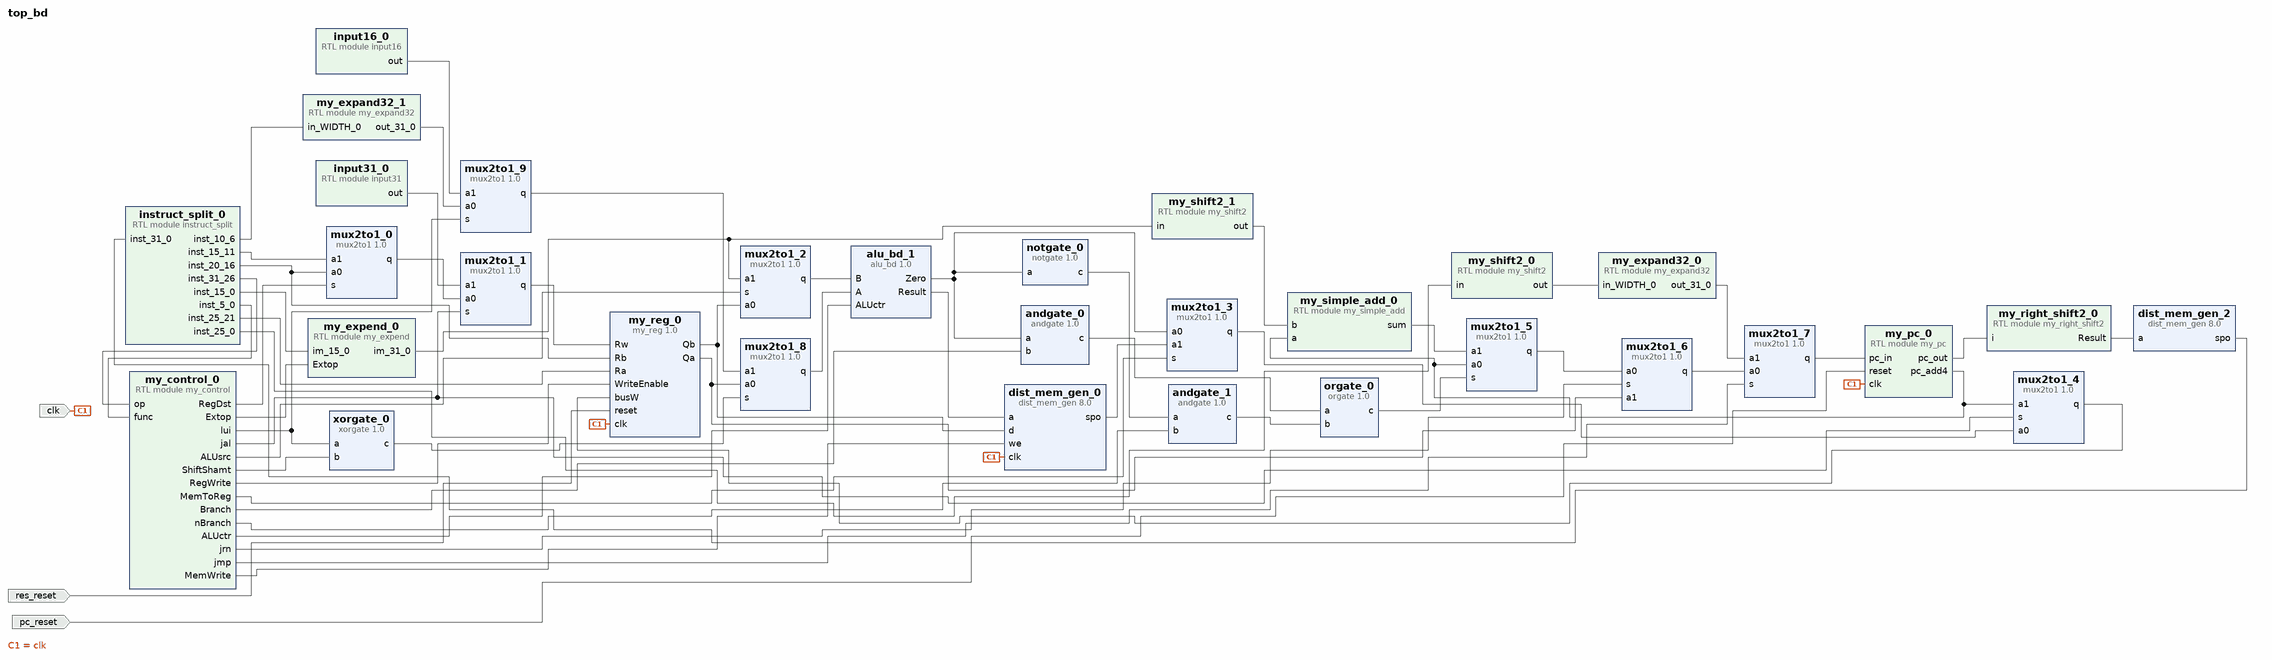
[diagram p0: block diagram of the top level]
# Vivado block design top_bd, Vivado 2015.4
create_bd_design top_bd

create_bd_port -dir I -type clk clk
set_property -dict {CONFIG.FREQ_HZ 1000000} [get_bd_ports clk]
create_bd_port -dir I pc_reset
create_bd_port -dir I res_reset

create_bd_cell -type ip -vlnv CSE:CSE:mux2to1:1.0 mux2to1_0
set_property -dict {CONFIG.WIDTH 5} [get_bd_cells mux2to1_0]
create_bd_cell -type ip -vlnv CSE:CSE:mux2to1:1.0 mux2to1_1
set_property -dict {CONFIG.WIDTH 5} [get_bd_cells mux2to1_1]
create_bd_cell -type ip -vlnv CSE:CSE:mux2to1:1.0 mux2to1_2
set_property -dict {CONFIG.WIDTH 32} [get_bd_cells mux2to1_2]
create_bd_cell -type ip -vlnv CSE:CSE:mux2to1:1.0 mux2to1_3
set_property -dict {CONFIG.WIDTH 32} [get_bd_cells mux2to1_3]
create_bd_cell -type ip -vlnv CSE:CSE:mux2to1:1.0 mux2to1_4
set_property -dict {CONFIG.WIDTH 32} [get_bd_cells mux2to1_4]
create_bd_cell -type ip -vlnv CSE:CSE:mux2to1:1.0 mux2to1_5
set_property -dict {CONFIG.WIDTH 32} [get_bd_cells mux2to1_5]
create_bd_cell -type ip -vlnv CSE:CSE:andgate:1.0 andgate_0
set_property -dict {CONFIG.WIDTH 1} [get_bd_cells andgate_0]
create_bd_cell -type ip -vlnv CSE:CSE:andgate:1.0 andgate_1
set_property -dict {CONFIG.WIDTH 1} [get_bd_cells andgate_1]
create_bd_cell -type ip -vlnv CSE:CSE:notgate:1.0 notgate_0
set_property -dict {CONFIG.WIDTH 1} [get_bd_cells notgate_0]
create_bd_cell -type ip -vlnv CSE:CSE:orgate:1.0 orgate_0
set_property -dict {CONFIG.WIDTH 1} [get_bd_cells orgate_0]
create_bd_cell -type module -reference my_expend my_expend_0
create_bd_cell -type module -reference my_expand32 my_expand32_0
set_property -dict {CONFIG.WIDTH 26} [get_bd_cells my_expand32_0]
create_bd_cell -type module -reference my_simple_add my_simple_add_0
set_property -dict {CONFIG.WIDTH 32} [get_bd_cells my_simple_add_0]
create_bd_cell -type ip -vlnv CSE:CSE:mux2to1:1.0 mux2to1_6
set_property -dict {CONFIG.WIDTH 32} [get_bd_cells mux2to1_6]
create_bd_cell -type ip -vlnv CSE:CSE:mux2to1:1.0 mux2to1_7
set_property -dict {CONFIG.WIDTH 32} [get_bd_cells mux2to1_7]
create_bd_cell -type module -reference instruct_split instruct_split_0
create_bd_cell -type ip -vlnv CSE:CSE:mux2to1:1.0 mux2to1_8
set_property -dict {CONFIG.WIDTH 32} [get_bd_cells mux2to1_8]
create_bd_cell -type ip -vlnv CSE:CSE:mux2to1:1.0 mux2to1_9
set_property -dict {CONFIG.WIDTH 32} [get_bd_cells mux2to1_9]
create_bd_cell -type module -reference input16 input16_0
create_bd_cell -type ip -vlnv CSE:CSE:xorgate:1.0 xorgate_0
set_property -dict {CONFIG.WIDTH 1} [get_bd_cells xorgate_0]
create_bd_cell -type module -reference my_right_shift2 my_right_shift2_0
create_bd_cell -type module -reference my_pc my_pc_0
create_bd_cell -type module -reference my_shift2 my_shift2_1
set_property -dict {CONFIG.WIDTH 32} [get_bd_cells my_shift2_1]
create_bd_cell -type module -reference input31 input31_0
create_bd_cell -type module -reference my_control my_control_0
create_bd_cell -type ip -vlnv CSE:CSE:my_reg:1.0 my_reg_0
create_bd_cell -type ip -vlnv CSE:CSE:alu_bd:1.0 alu_bd_1
create_bd_cell -type module -reference my_expand32 my_expand32_1
set_property -dict {CONFIG.WIDTH 5} [get_bd_cells my_expand32_1]
create_bd_cell -type module -reference my_shift2 my_shift2_0
set_property -dict {CONFIG.WIDTH 26} [get_bd_cells my_shift2_0]
create_bd_cell -type ip -vlnv xilinx.com:ip:dist_mem_gen:8.0 dist_mem_gen_2
set_property -dict [list \
  CONFIG.depth 65536 \
  CONFIG.data_width 32 \
  CONFIG.memory_type rom \
  CONFIG.coefficient_file ../../../../../../../../SOC/CPU/UnitTest/fib/prgmip32.coe \
] [get_bd_cells dist_mem_gen_2]
create_bd_cell -type ip -vlnv xilinx.com:ip:dist_mem_gen:8.0 dist_mem_gen_0
set_property -dict [list \
  CONFIG.depth 65536 \
  CONFIG.data_width 32 \
  CONFIG.coefficient_file ../../../../../../../../SOC/CPU/UnitTest/fib/dmem32.coe \
] [get_bd_cells dist_mem_gen_0]

# ---- connections ----

connect_bd_net [get_bd_pins my_pc_0/pc_out] [get_bd_pins my_right_shift2_0/i]
connect_bd_net [get_bd_pins instruct_split_0/inst_31_26] [get_bd_pins my_control_0/op]
connect_bd_net [get_bd_pins instruct_split_0/inst_5_0] [get_bd_pins my_control_0/func]
connect_bd_net [get_bd_pins instruct_split_0/inst_15_0] [get_bd_pins my_expend_0/im_15_0]
connect_bd_net [get_bd_pins my_control_0/jal] [get_bd_pins mux2to1_1/s] [get_bd_pins mux2to1_4/s]
connect_bd_net [get_bd_pins my_control_0/RegDst] [get_bd_pins mux2to1_0/s]
connect_bd_net [get_bd_pins mux2to1_0/q] [get_bd_pins mux2to1_1/a0]
connect_bd_net [get_bd_pins my_expend_0/im_31_0] [get_bd_pins mux2to1_2/a1] [get_bd_pins my_shift2_1/in]
connect_bd_net [get_bd_pins my_control_0/ALUsrc] [get_bd_pins mux2to1_2/s]
connect_bd_net [get_bd_pins my_control_0/MemToReg] [get_bd_pins mux2to1_3/s]
connect_bd_net [get_bd_pins my_pc_0/pc_add4] [get_bd_pins mux2to1_4/a1] [get_bd_pins my_simple_add_0/a] [get_bd_pins mux2to1_5/a0]
connect_bd_net [get_bd_pins mux2to1_3/q] [get_bd_pins mux2to1_4/a0]
connect_bd_net [get_bd_pins my_control_0/Extop] [get_bd_pins my_expend_0/Extop]
connect_bd_net [get_bd_pins andgate_0/c] [get_bd_pins orgate_0/a]
connect_bd_net [get_bd_pins andgate_1/c] [get_bd_pins orgate_0/b]
connect_bd_net [get_bd_pins my_control_0/nBranch] [get_bd_pins andgate_1/b]
connect_bd_net [get_bd_pins my_control_0/Branch] [get_bd_pins andgate_0/b]
connect_bd_net [get_bd_pins orgate_0/c] [get_bd_pins mux2to1_5/s]
connect_bd_net [get_bd_pins my_shift2_1/out] [get_bd_pins my_simple_add_0/b]
connect_bd_net [get_bd_pins my_simple_add_0/sum] [get_bd_pins mux2to1_5/a1]
connect_bd_net [get_bd_pins mux2to1_5/q] [get_bd_pins mux2to1_6/a0]
connect_bd_net [get_bd_pins my_control_0/jrn] [get_bd_pins mux2to1_6/s]
connect_bd_net [get_bd_pins mux2to1_6/q] [get_bd_pins mux2to1_7/a0]
connect_bd_net [get_bd_pins my_expand32_0/out_31_0] [get_bd_pins mux2to1_7/a1]
connect_bd_net [get_bd_pins my_control_0/jmp] [get_bd_pins mux2to1_7/s]
connect_bd_net [get_bd_pins mux2to1_7/q] [get_bd_pins my_pc_0/pc_in]
connect_bd_net [get_bd_ports clk] [get_bd_pins my_pc_0/clk] [get_bd_pins my_reg_0/clk] [get_bd_pins dist_mem_gen_0/clk]
connect_bd_net [get_bd_ports pc_reset] [get_bd_pins my_pc_0/reset]
connect_bd_net [get_bd_pins instruct_split_0/inst_10_6] [get_bd_pins my_expand32_1/in_WIDTH_0]
connect_bd_net [get_bd_pins my_control_0/lui] [get_bd_pins mux2to1_9/s] [get_bd_pins xorgate_0/a]
connect_bd_net [get_bd_pins input16_0/out] [get_bd_pins mux2to1_9/a1]
connect_bd_net [get_bd_pins my_expand32_1/out_31_0] [get_bd_pins mux2to1_9/a0]
connect_bd_net [get_bd_pins mux2to1_9/q] [get_bd_pins mux2to1_8/a1]
connect_bd_net [get_bd_pins my_control_0/ShiftShamt] [get_bd_pins xorgate_0/b]
connect_bd_net [get_bd_pins xorgate_0/c] [get_bd_pins mux2to1_8/s]
connect_bd_net [get_bd_pins instruct_split_0/inst_15_11] [get_bd_pins mux2to1_0/a1]
connect_bd_net [get_bd_pins input31_0/out] [get_bd_pins mux2to1_1/a1]
connect_bd_net [get_bd_pins notgate_0/c] [get_bd_pins andgate_1/a]
connect_bd_net [get_bd_pins my_shift2_0/out] [get_bd_pins my_expand32_0/in_WIDTH_0]
connect_bd_net [get_bd_pins instruct_split_0/inst_25_0] [get_bd_pins my_shift2_0/in]
connect_bd_net [get_bd_ports res_reset] [get_bd_pins my_reg_0/reset]
connect_bd_net [get_bd_pins mux2to1_1/q] [get_bd_pins my_reg_0/Rw]
connect_bd_net [get_bd_pins instruct_split_0/inst_25_21] [get_bd_pins my_reg_0/Ra]
connect_bd_net [get_bd_pins instruct_split_0/inst_20_16] [get_bd_pins mux2to1_0/a0] [get_bd_pins my_reg_0/Rb]
connect_bd_net [get_bd_pins my_control_0/RegWrite] [get_bd_pins my_reg_0/WriteEnable]
connect_bd_net [get_bd_pins mux2to1_4/q] [get_bd_pins my_reg_0/busW]
connect_bd_net [get_bd_pins my_reg_0/Qa] [get_bd_pins mux2to1_6/a1] [get_bd_pins mux2to1_8/a0]
connect_bd_net [get_bd_pins my_reg_0/Qb] [get_bd_pins mux2to1_2/a0] [get_bd_pins dist_mem_gen_0/d]
connect_bd_net [get_bd_pins mux2to1_8/q] [get_bd_pins alu_bd_1/A]
connect_bd_net [get_bd_pins my_control_0/ALUctr] [get_bd_pins alu_bd_1/ALUctr]
connect_bd_net [get_bd_pins mux2to1_2/q] [get_bd_pins alu_bd_1/B]
connect_bd_net [get_bd_pins alu_bd_1/Zero] [get_bd_pins andgate_0/a] [get_bd_pins notgate_0/a] [get_bd_pins mux2to1_3/a0]
connect_bd_net [get_bd_pins my_right_shift2_0/Result] [get_bd_pins dist_mem_gen_2/a]
connect_bd_net [get_bd_pins dist_mem_gen_2/spo] [get_bd_pins instruct_split_0/inst_31_0]
connect_bd_net [get_bd_pins alu_bd_1/Result] [get_bd_pins dist_mem_gen_0/a]
connect_bd_net [get_bd_pins my_control_0/MemWrite] [get_bd_pins dist_mem_gen_0/we]
connect_bd_net [get_bd_pins dist_mem_gen_0/spo] [get_bd_pins mux2to1_3/a1]

validate_bd_design
save_bd_design
